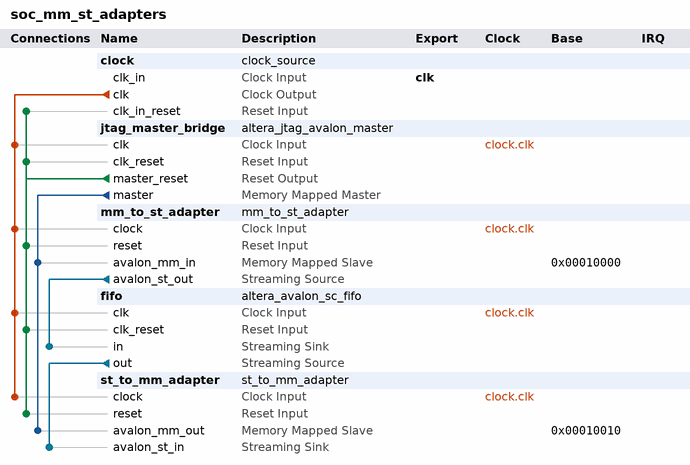
[diagram p0: system contents]
# Platform Designer (Qsys) system soc_mm_st_adapters, Cyclone V 5CSXFC6C6U23C8ES
# Parameters at their usual value, and those the tool derives, are not listed.
package require -exact qsys 13.1
create_system soc_mm_st_adapters
set_project_property DEVICE_FAMILY {Cyclone V}
set_project_property DEVICE 5CSXFC6C6U23C8ES

add_instance clock clock_source 13.1
set_instance_parameter_value clock clockFrequency 50000000

add_instance jtag_master_bridge altera_jtag_avalon_master 13.1

add_instance mm_to_st_adapter mm_to_st_adapter 1.0
set_instance_parameter_value mm_to_st_adapter WIDTH 8

add_instance fifo altera_avalon_sc_fifo 13.1
set_instance_parameter_value fifo BITS_PER_SYMBOL 8
set_instance_parameter_value fifo FIFO_DEPTH 16
set_instance_parameter_value fifo CHANNEL_WIDTH 0
set_instance_parameter_value fifo ERROR_WIDTH 0
set_instance_parameter_value fifo USE_PACKETS 1
set_instance_parameter_value fifo USE_FILL_LEVEL 0
set_instance_parameter_value fifo USE_MEMORY_BLOCKS 1
set_instance_parameter_value fifo USE_STORE_FORWARD 0

add_instance st_to_mm_adapter st_to_mm_adapter 1.0
set_instance_parameter_value st_to_mm_adapter WIDTH 8

# connections
add_connection clock.clk fifo.clk clock
add_connection clock.clk jtag_master_bridge.clk clock
add_connection clock.clk mm_to_st_adapter.clock clock
add_connection clock.clk st_to_mm_adapter.clock clock
add_connection jtag_master_bridge.master_reset clock.clk_in_reset reset
add_connection jtag_master_bridge.master_reset fifo.clk_reset reset
add_connection jtag_master_bridge.master_reset jtag_master_bridge.clk_reset reset
add_connection jtag_master_bridge.master_reset mm_to_st_adapter.reset reset
add_connection jtag_master_bridge.master_reset st_to_mm_adapter.reset reset
add_connection jtag_master_bridge.master mm_to_st_adapter.avalon_mm_in avalon
set_connection_parameter_value jtag_master_bridge.master/mm_to_st_adapter.avalon_mm_in baseAddress 0x00010000
add_connection jtag_master_bridge.master st_to_mm_adapter.avalon_mm_out avalon
set_connection_parameter_value jtag_master_bridge.master/st_to_mm_adapter.avalon_mm_out baseAddress 0x00010010
add_connection fifo.out st_to_mm_adapter.avalon_st_in avalon_streaming
add_connection mm_to_st_adapter.avalon_st_out fifo.in avalon_streaming

# exported interfaces
add_interface clk clock sink
set_interface_property clk EXPORT_OF clock.clk_in

set_interconnect_requirement {$system} qsys_mm.clockCrossingAdapter HANDSHAKE
set_interconnect_requirement {$system} qsys_mm.maxAdditionalLatency 1
set_interconnect_requirement {$system} qsys_mm.insertDefaultSlave false

save_system soc_mm_st_adapters.qsys
